# Altium project adxl357.PrjPcb
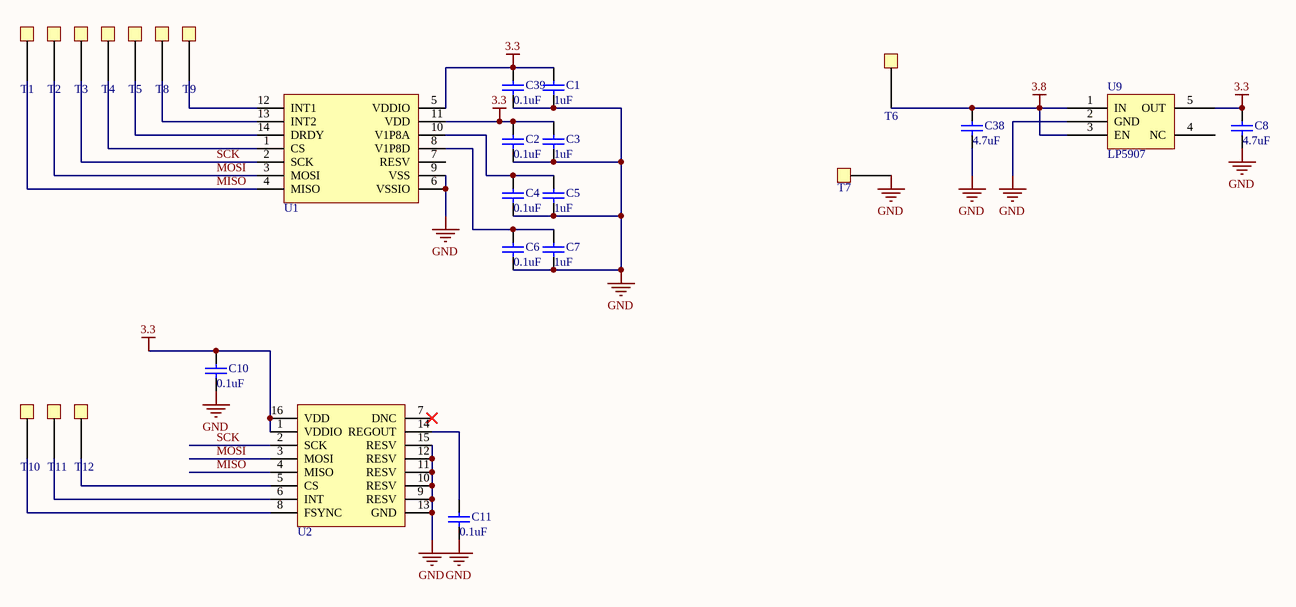
[diagram p0: adxl357.SchDoc]
1 sheet, 27 parts. Net scope: global (net labels, ports and power ports of the same name join across sheets).
Board file: adxl357.PcbDoc

## Sheet adxl357.SchDoc
size A4

### Parts
C1  1uF  [0402]
C2  0.1uF  [0402]
C3  1uF  [0402]
C4  0.1uF  [0402]
C5  1uF  [0402]
C6  0.1uF  [0402]
C7  1uF  [0402]
C8  4.7uF  [0603L]
C10  0.1uF  [0402]
C11  0.1uF  [0402]
C38  4.7uF  [0603L]
C39  0.1uF  [0402]
T1  TestPad  [TestPad - 1mm]  (value not drawn)
T2  TestPad  [TestPad - 1mm]  (value not drawn)
T3  TestPad  [TestPad - 1mm]  (value not drawn)
T4  TestPad  [TestPad - 1mm]  (value not drawn)
T5  TestPad  [TestPad - 1mm]  (value not drawn)
T6  TestPad  [TestPad - 1mm]  (value not drawn)
T7  TestPad  [TestPad - 1mm]  (value not drawn)
T8  TestPad  [TestPad - 1mm]  (value not drawn)
T9  TestPad  [TestPad - 1mm]  (value not drawn)
T10  TestPad  [TestPad - 1mm]  (value not drawn)
T11  TestPad  [TestPad - 1mm]  (value not drawn)
T12  TestPad  [TestPad - 1mm]  (value not drawn)
U1  ADXL357  [ADXL357]  (value not drawn)
U2  ICM20602  [ICM20602]  (value not drawn)
U9  LP5907  [SOT23-5]

### Nets
3.3: C1.2 C2.2 C3.2 C8.2 C10.2 C39.2 U1.5(VDDIO) U1.11(VDD) U2.1(VDDIO) U2.16(VDD) U9.5(OUT)
3.8: C38.2 T6.1 U9.1(IN) U9.3(EN)
GND: C1.1 C2.1 C3.1 C4.1 C5.1 C6.1 C7.1 C8.1 C10.1 C11.1 C38.1 C39.1 T7.1 U1.6(VSSIO) U1.9(VSS) U2.9(RESV) U2.10(RESV) U2.11(RESV) U2.12(RESV) U2.13(GND) U2.15(RESV) U9.2(GND)
MISO: T1.1 U1.4(MISO) U2.4(MISO)
MOSI: T2.1 U1.3(MOSI) U2.3(MOSI)
SCK: T3.1 U1.2(SCK) U2.2(SCK)
NetC4_2: C4.2 C5.2 U1.10(V1P8A)
NetC6_2: C6.2 C7.2 U1.8(V1P8D)
NetC11_2: C11.2 U2.14(REGOUT)
NetT4_1: T4.1 U1.1(CS)
NetT5_1: T5.1 U1.14(DRDY)
NetT8_1: T8.1 U1.13(INT2)
NetT9_1: T9.1 U1.12(INT1)
NetT10_1: T10.1 U2.8(FSYNC)
NetT11_1: T11.1 U2.6(INT)
NetT12_1: T12.1 U2.5(CS)

Not connected (* = marked no-connect by the designer): U1 7(RESV); U2 7(DNC)*; U9 4(NC)

### Library data of the parts
C1-C8 C10 C11 C38 C39 = Cap: Capacitor; Published: 8-Jun-2000; LatestRevisionDate: 17-Jul-2002; LatestRevisionNote: Re-released for DXP Platform.; PackageReference: RAD-0.3; Publisher: Altium Limited; PackageDescription: Radial Cap, Thru-Hole; 2 Leads; 0.3 in Pin Spacing